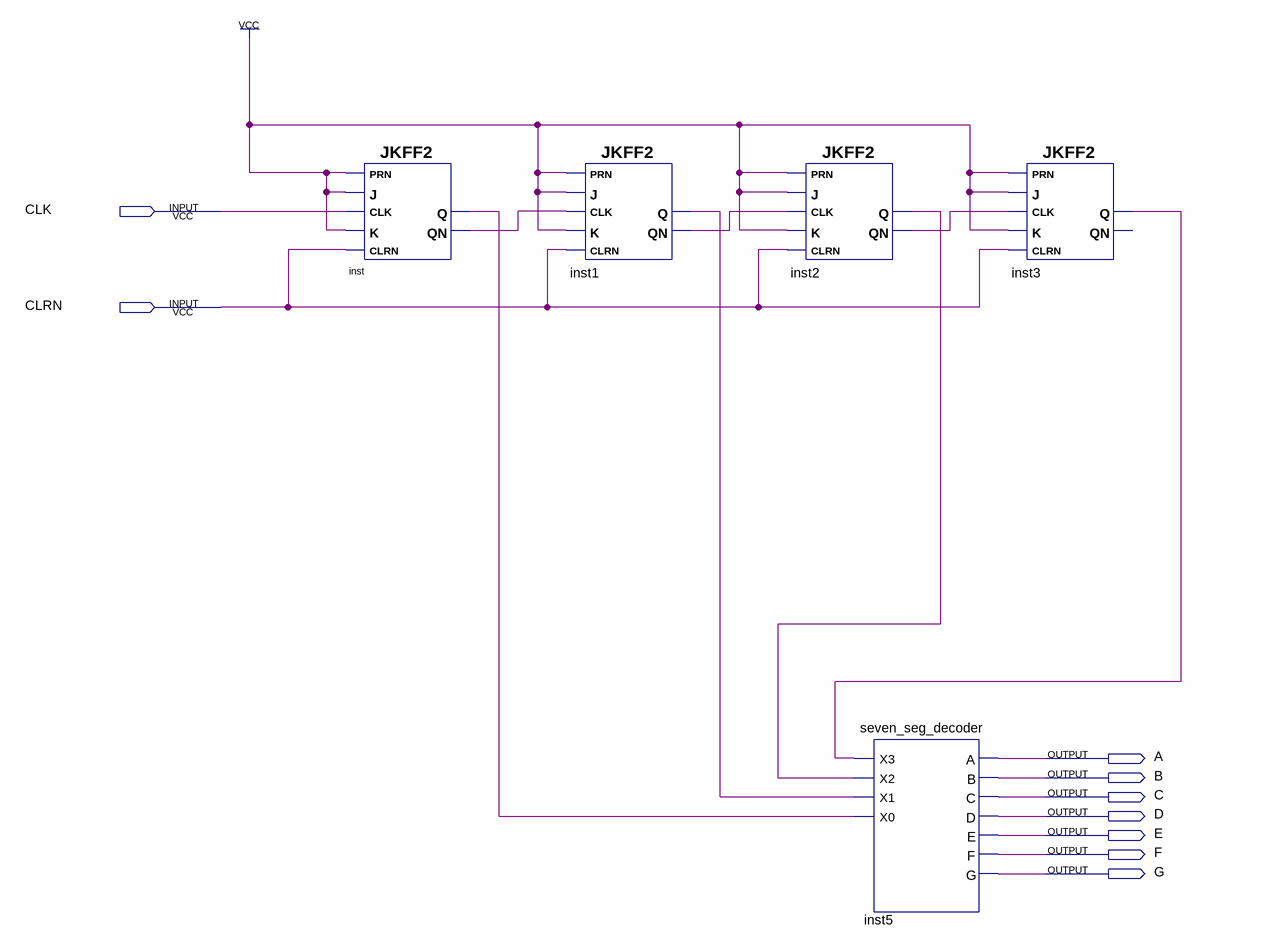
[diagram p0: schematic sheet]
// Quartus schematic lab10step3a.bdf as structural Verilog: 5 symbols, 9 pins
module lab10step3a (
  input  CLK,
  input  CLRN,
  output A,
  output B,
  output C,
  output D,
  output E,
  output F,
  output G
);

  wire inst1_q, inst1_qn, inst2_q, inst2_qn, inst3_q, inst_q, inst_qn;

  JKFF2 inst (.K(1'b1), .CLRN(CLRN), .CLK(CLK), .PRN(1'b1), .J(1'b1), .QN(inst_qn), .Q(inst_q));
  JKFF2 inst1 (.K(1'b1), .CLRN(CLRN), .CLK(inst_qn), .PRN(1'b1), .J(1'b1), .QN(inst1_qn), .Q(inst1_q));
  JKFF2 inst2 (.K(1'b1), .CLRN(CLRN), .CLK(inst1_qn), .PRN(1'b1), .J(1'b1), .QN(inst2_qn), .Q(inst2_q));
  seven_seg_decoder inst5 (
    .X3(inst3_q), .X2(inst2_q), .X1(inst1_q), .X0(inst_q), .A(A), .B(B), .C(C), .D(D), .E(E), .F(F), .G(G));
  JKFF2 inst3 (.K(1'b1), .CLRN(CLRN), .CLK(inst2_qn), .PRN(1'b1), .J(1'b1), .Q(inst3_q));  // open: QN
endmodule
